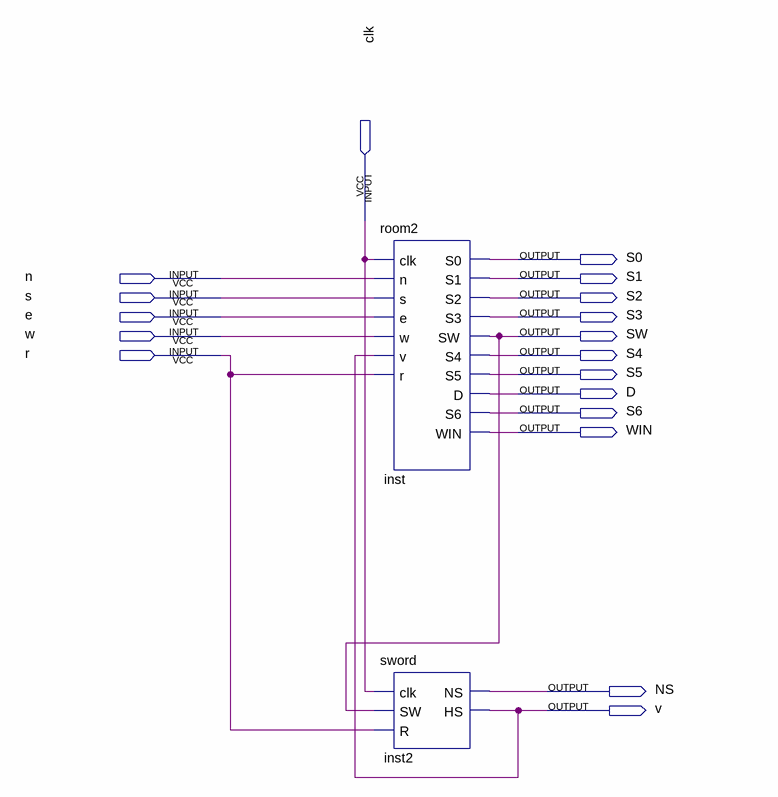
[diagram p0: schematic sheet]
// Quartus schematic Game.bdf as structural Verilog: 2 symbols, 18 pins
module Game (
  input  clk,
  input  n,
  input  s,
  input  e,
  input  w,
  input  r,
  output S0,
  output S1,
  output S2,
  output S3,
  output SW,
  output S4,
  output S5,
  output D,
  output S6,
  output WIN,
  output NS,
  output v
);

  room2 inst (
    .clk(clk), .n(n), .s(s), .e(e), .w(w), .v(v), .r(r), .S0(S0), .S1(S1), .S2(S2), .S3(S3), .SW(SW),
    .S4(S4), .S5(S5), .D(D), .S6(S6), .WIN(WIN));
  sword inst2 (.clk(clk), .SW(SW), .R(r), .NS(NS), .HS(v));
endmodule
